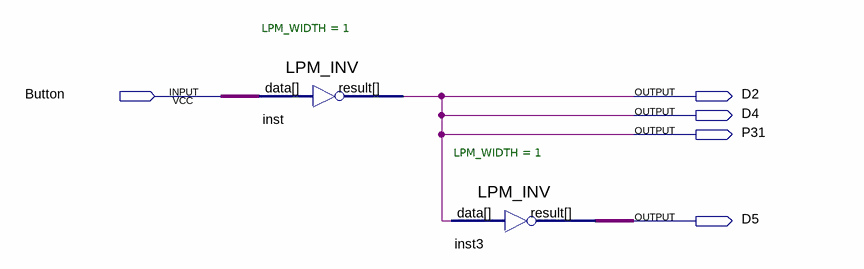
[diagram p0: schematic sheet]
// Quartus schematic Blink2.bdf as structural Verilog: 2 symbols, 5 pins
module Blink2 (
  input  Button,
  output D2,
  output D4,
  output P31,
  output D5
);

  LPM_INV #(.LPM_WIDTH(1)) inst (.data(Button), .result(D2));
  LPM_INV #(.LPM_WIDTH(1)) inst3 (.data(D2), .result(D5));

  assign D4 = D2;
  assign P31 = D2;
endmodule
